# Altium schematic sheet LiDAR .SchDoc
size A4; SheetNumber: 26; SheetTotal: 32
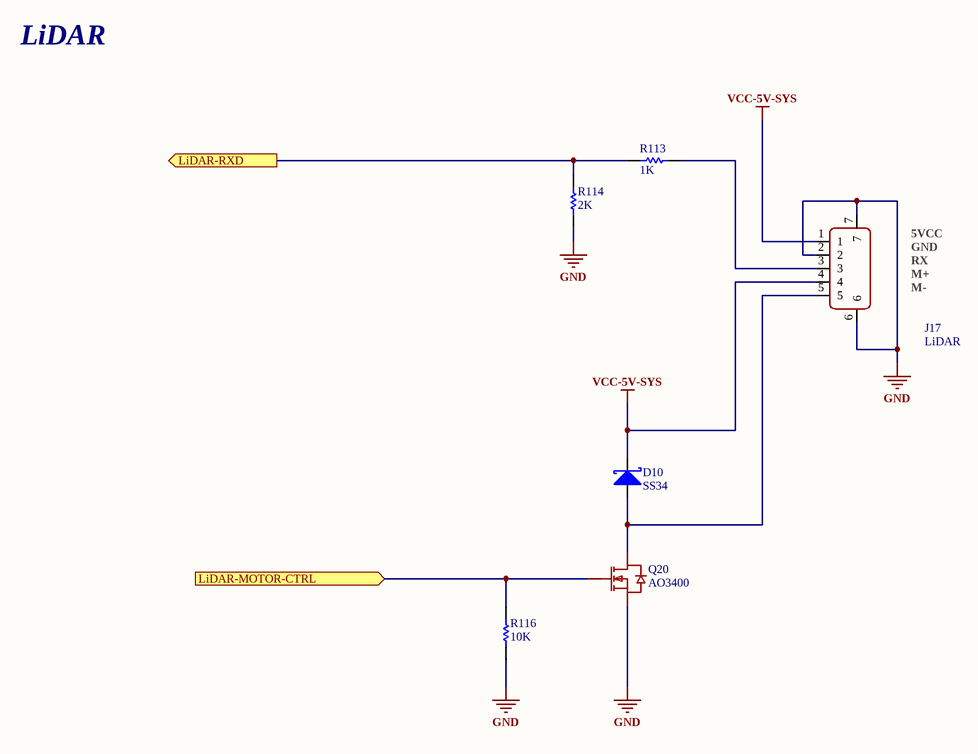
[diagram p0: LiDAR .SchDoc]

## Parts
D10  SS34  [SMA]
J17  LiDAR  [CONN-SMD_5P-P1.25_XUNPU_WAFER-GH1.25-5PWB]
Q20  AO3400  [SOT23-3D]
R113  1K  [RES-0402]
R114  2K  [RES-0402]
R116  10K  [RES-0402]

## Ports
LiDAR-MOTOR-CTRL (in, see Controller-RK3562-TOP[7B]), LiDAR-RXD (out, see Controller-RK3562-TOP[7B], CONTROLLER-RK3562[3C])

## Nets
GND: J17.2 J17.6 J17.7 Q20.2(S) R114.1 R116.1
VCC-5V-SYS: D10.2(K) J17.1 J17.4
LiDAR-MOTOR-CTRL: Q20.1(G) R116.2 ; port LiDAR-MOTOR-CTRL
LiDAR-RXD: R113.1 R114.2 ; port LiDAR-RXD
NetD10_1: D10.1(A) J17.5 Q20.3(D)
NetJ17_3: J17.3 R113.2

## Notes on the sheet
- LiDAR
- 5VCC
- GND
- RX
- M+
- M-

## Library data of the parts
D10 = DIODE-2: ManufacturingPartNumber: *; Manufacturer: *; SupplierPartNumber: *; Supplier: *; VoltageRate: *
J17 = HDRx5: WAFER-GH1.25-5PWB; ManufacturingPartNumber: *; Manufacturer: *; SupplierPartNumber: *; Supplier: *; VoltageRate: *
Q20 = N-MOS-SOT23: ManufacturingPartNumber: *; Manufacturer: *; SupplierPartNumber: *; Supplier: *; VoltageRate: *
R113 R114 R116 = Resistor-1: ManufacturingPartNumber: *; Manufacturer: *; SupplierPartNumber: *; Supplier: *; VoltageRate: *